# Altium schematic sheet SOC_COMPHY_USB.schdoc: =
size A3; Symbol: Sheet-Symbol_A4; Company: 嘉立创EDA; Version: V1.0; Page Size: A4; @Project Name: RK3568_LPD4X_120P_Core; @Page Count: 18; @Update Date: 2025-08-22; @Create Date: 2025-08-15; @Schematic Name: Schematic1; @Page No: 8; @Page Name: SOC_COMPHY/USB; Device: Sheet-Symbol_A4; Border: 1; Title Block Position: 3; Width: 1655; Height: 1170; Region Start: 1; X Region Count: 6; Y Region Count: 4; Blade Width: 10; @Board Name: Board1; @Create Time: 13:46:06; @Update Time: 16:42:04; Organization: ORGANIZATION; Address1: ADDRESS 1; Address2: ADDRESS 2; Address3: ADDRESS 3; Address4: ADDRESS 4; SheetNumber: 10; SheetTotal: 28
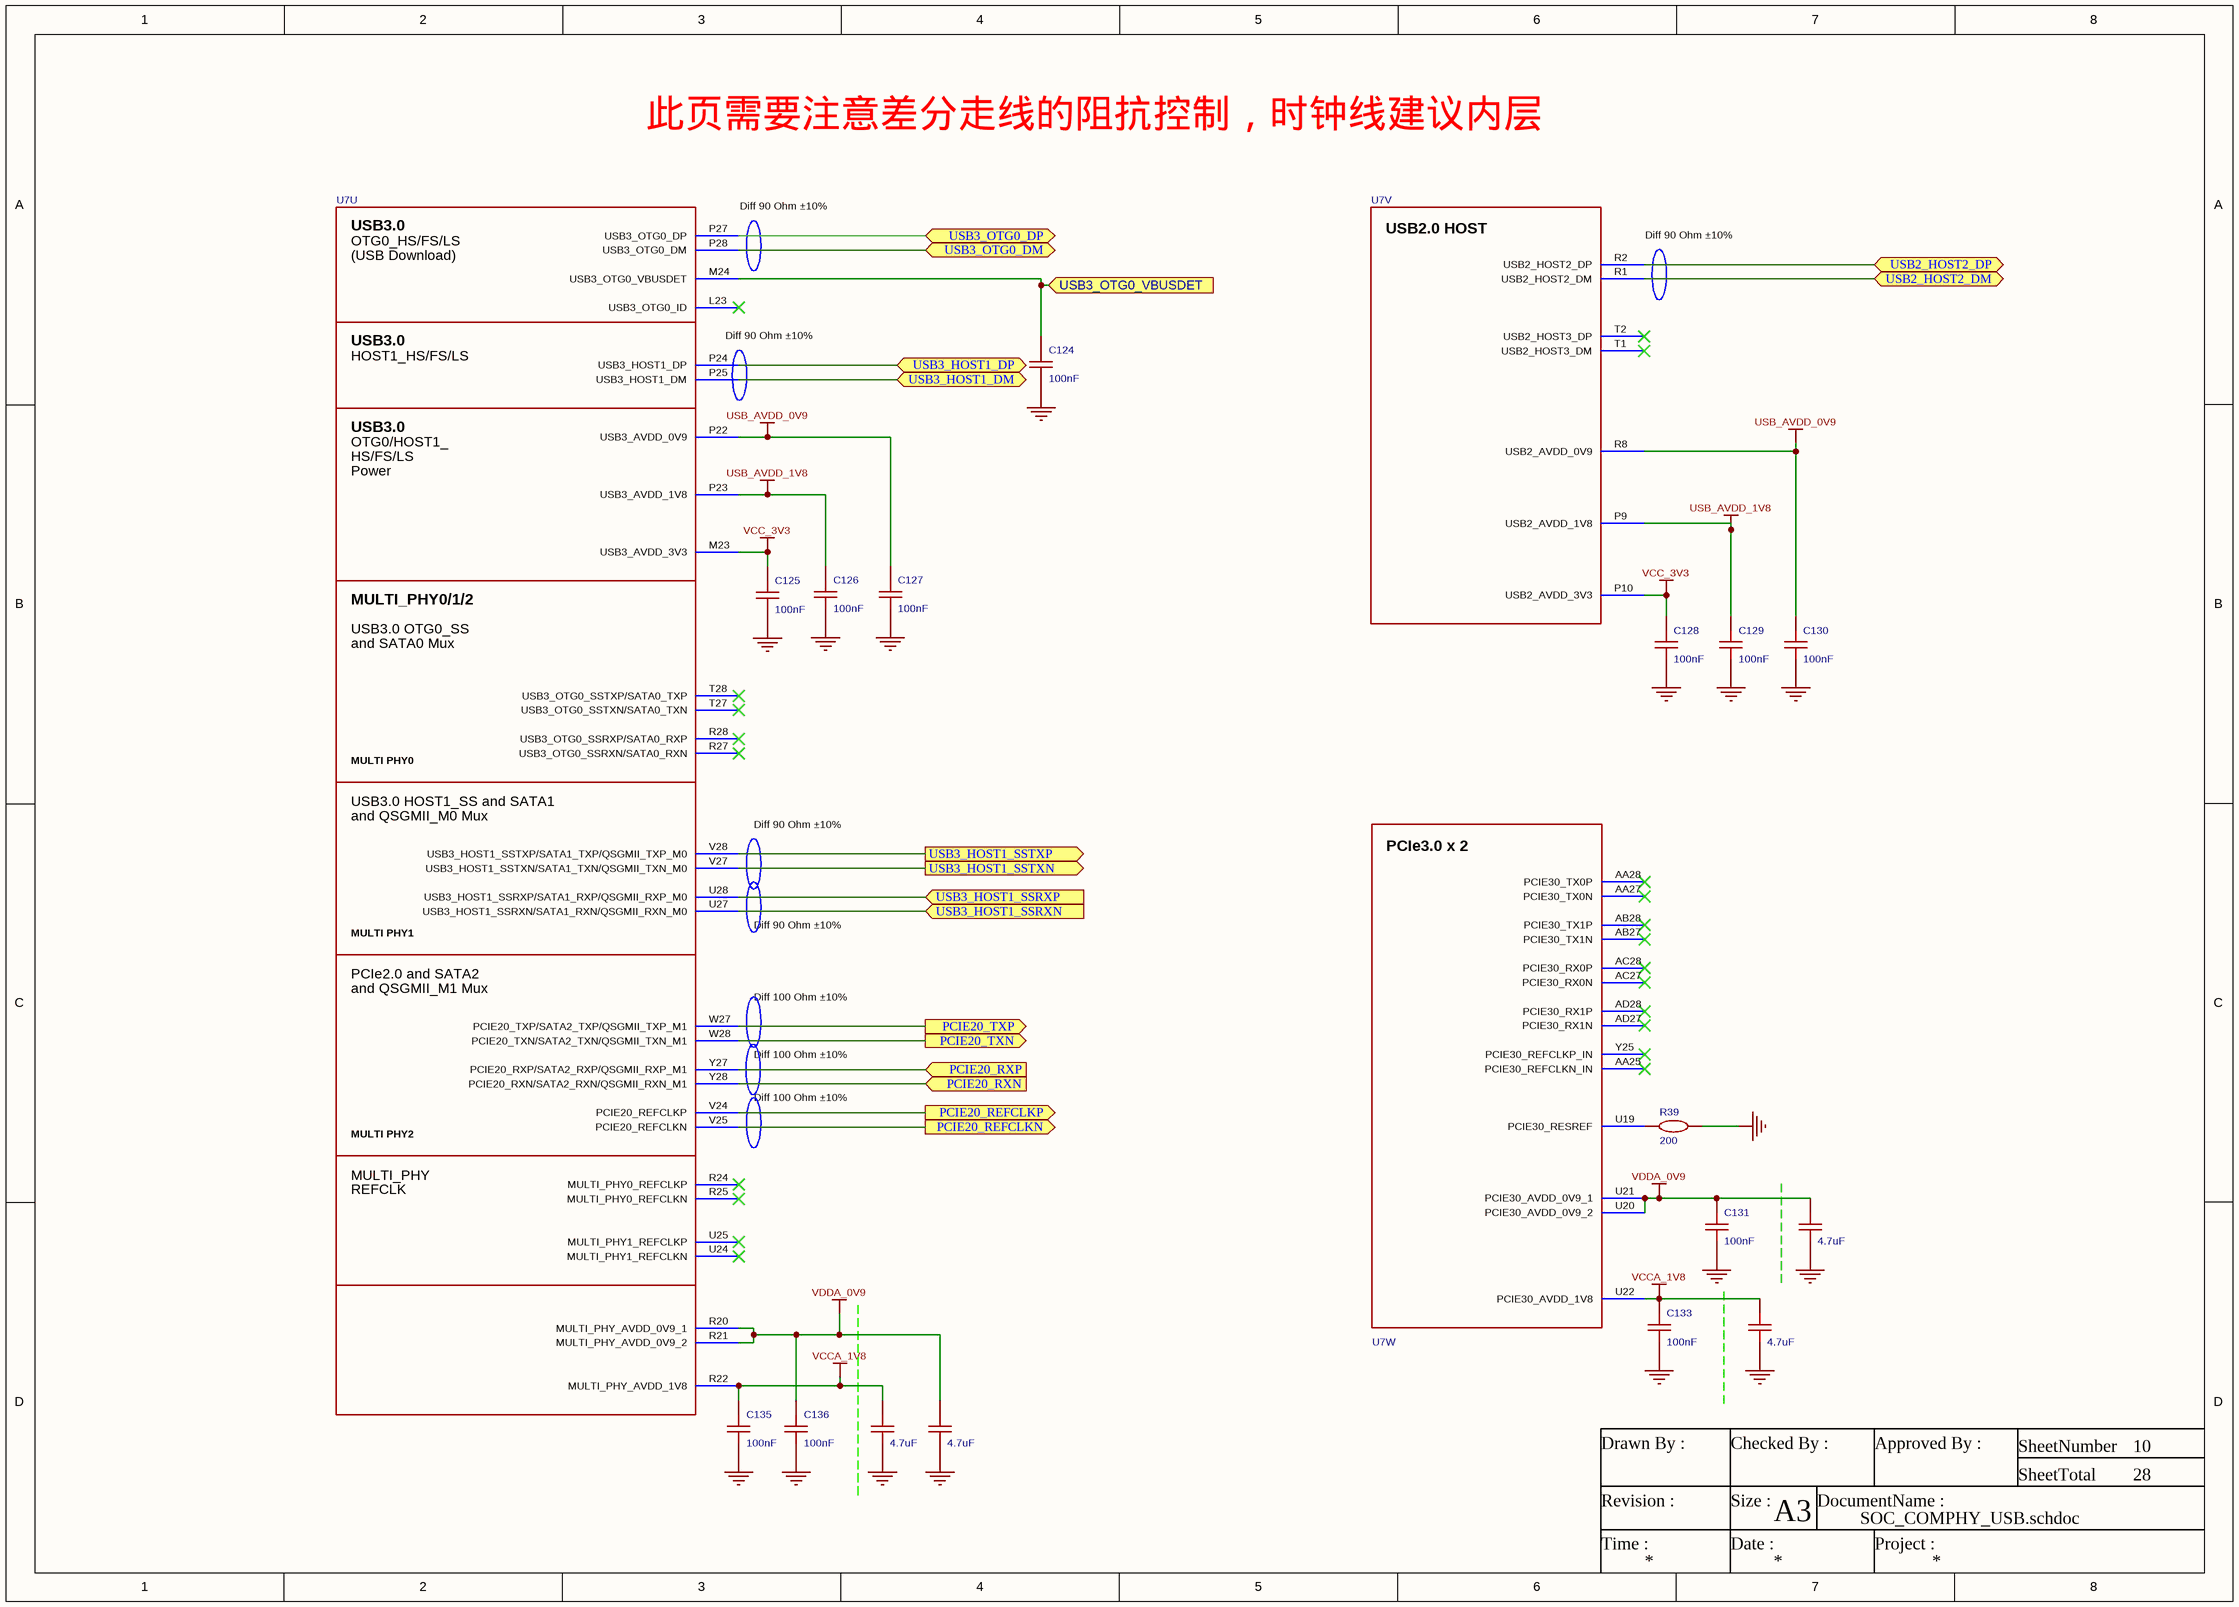
[diagram p0: SOC_COMPHY_USB.schdoc]

## Parts
C124  100nF  [C0201]
C125  100nF  [C0201]
C126  100nF  [C0201]
C127  100nF  [C0201]
C128  100nF  [C0201]
C129  100nF  [C0201]
C130  100nF  [C0201]
C131  100nF  [C0201]
C132  value 4.7uF  [MYC0402]  (hidden comment: CL10A105KB8NNNC)
C133  100nF  [C0201]
C134  value 4.7uF  [MYC0402]  (hidden comment: CL10A105KB8NNNC)
C135  100nF  [C0201]
C136  100nF  [C0201]
C137  value 4.7uF  [MYC0402]  (hidden comment: CL10A105KB8NNNC)
C138  value 4.7uF  [MYC0402]  (hidden comment: CL10A105KB8NNNC)
R39  200  [R0201]
U7  RK3568  [BGA-636_L19.0-W19.0-P0.65-BL]  (value not drawn)  (parts U,V,W of 23)

## Ports
PCIE20_REFCLKN (out), PCIE20_REFCLKP (out), PCIE20_RXN (in), PCIE20_RXP (in), PCIE20_TXN (out), PCIE20_TXP (out), USB2_HOST2_DM (bidir), USB2_HOST2_DP (bidir), USB3_HOST1_DM (bidir), USB3_HOST1_DP (bidir), USB3_HOST1_SSRXN (in), USB3_HOST1_SSRXP (in), USB3_HOST1_SSTXN (out), USB3_HOST1_SSTXP (out), USB3_OTG0_DM (bidir), USB3_OTG0_DP (bidir), USB3_OTG0_VBUSDET (in)

## Nets
GND: C124.1 C125.1 C126.1 C127.1 C128.1 C129.1 C130.1 C131.1 C132.1 C133.1 C134.1 C135.1 C136.1 C137.1 C138.1 R39.2
USB_AVDD_0V9: C127.2 C130.2 U7.P22(USB3_AVDD_0V9) U7.R8(USB2_AVDD_0V9)
USB_AVDD_1V8: C126.2 C129.2 U7.P9(USB2_AVDD_1V8) U7.P23(USB3_AVDD_1V8)
VCC_3V3: C125.2 C128.2 U7.M23(USB3_AVDD_3V3) U7.P10(USB2_AVDD_3V3)
VCCA_1V8: C133.2 C134.2 C135.2 C137.2 U7.R22(MULTI_PHY_AVDD_1V8) U7.U22(PCIE30_AVDD_1V8)
VDDA_0V9: C131.2 C132.2 C136.2 C138.2 U7.R20(MULTI_PHY_AVDD_0V9_1) U7.R21(MULTI_PHY_AVDD_0V9_2) U7.U20(PCIE30_AVDD_0V9_2) U7.U21(PCIE30_AVDD_0V9_1)
PCIE20_REFCLKN: U7.V25(PCIE20_REFCLKN) ; port PCIE20_REFCLKN
PCIE20_REFCLKP: U7.V24(PCIE20_REFCLKP) ; port PCIE20_REFCLKP
PCIE20_RXN: U7.Y28(PCIE20_RXN/SATA2_RXN/QSGMII_RXN_M1) ; port PCIE20_RXN
PCIE20_RXP: U7.Y27(PCIE20_RXP/SATA2_RXP/QSGMII_RXP_M1) ; port PCIE20_RXP
PCIE20_TXN: U7.W28(PCIE20_TXN/SATA2_TXN/QSGMII_TXN_M1) ; port PCIE20_TXN
PCIE20_TXP: U7.W27(PCIE20_TXP/SATA2_TXP/QSGMII_TXP_M1) ; port PCIE20_TXP
USB2_HOST2_DM: U7.R1(USB2_HOST2_DM) ; port USB2_HOST2_DM
USB2_HOST2_DP: U7.R2(USB2_HOST2_DP) ; port USB2_HOST2_DP
USB3_HOST1_DM: U7.P25(USB3_HOST1_DM) ; port USB3_HOST1_DM
USB3_HOST1_DP: U7.P24(USB3_HOST1_DP) ; port USB3_HOST1_DP
USB3_HOST1_SSRXN: U7.U27(USB3_HOST1_SSRXN/SATA1_RXN/QSGMII_RXN_M0) ; port USB3_HOST1_SSRXN
USB3_HOST1_SSRXP: U7.U28(USB3_HOST1_SSRXP/SATA1_RXP/QSGMII_RXP_M0) ; port USB3_HOST1_SSRXP
USB3_HOST1_SSTXN: U7.V27(USB3_HOST1_SSTXN/SATA1_TXN/QSGMII_TXN_M0) ; port USB3_HOST1_SSTXN
USB3_HOST1_SSTXP: U7.V28(USB3_HOST1_SSTXP/SATA1_TXP/QSGMII_TXP_M0) ; port USB3_HOST1_SSTXP
USB3_OTG0_DM: U7.P28(USB3_OTG0_DM) ; port USB3_OTG0_DM
USB3_OTG0_DP: U7.P27(USB3_OTG0_DP) ; port USB3_OTG0_DP
USB3_OTG0_VBUSDET: C124.2 U7.M24(USB3_OTG0_VBUSDET) ; port USB3_OTG0_VBUSDET
NetR39_1: R39.1 U7.U19(PCIE30_RESREF)

Not connected (* = marked no-connect by the designer): U7 AA25(PCIE30_REFCLKN_IN)* AA27(PCIE30_TX0N)* AA28(PCIE30_TX0P)* AB27(PCIE30_TX1N)* AB28(PCIE30_TX1P)* AC27(PCIE30_RX0N)* AC28(PCIE30_RX0P)* AD27(PCIE30_RX1N)* AD28(PCIE30_RX1P)* L23(USB3_OTG0_ID)* R24(MULTI_PHY0_REFCLKP)* R25(MULTI_PHY0_REFCLKN)* R27(USB3_OTG0_SSRXN/SATA0_RXN)* R28(USB3_OTG0_SSRXP/SATA0_RXP)* T1(USB2_HOST3_DM)* T2(USB2_HOST3_DP)* T27(USB3_OTG0_SSTXN/SATA0_TXN)* T28(USB3_OTG0_SSTXP/SATA0_TXP)* U24(MULTI_PHY1_REFCLKN)* U25(MULTI_PHY1_REFCLKP)* Y25(PCIE30_REFCLKP_IN)*

## Notes on the sheet
- 此页需要注意差分走线的阻抗控制，时钟线建议内层
- (near U7) Diff 90 Ohm ±10%
- Diff 90 Ohm ±10%
- Diff 100 Ohm ±10%
- Drawn By :
- Checked By :
- Approved By :
- SheetNumber
- SheetTotal
- Revision :
- Time :
- Size :
- Date :
- A3
- DocumentName :
- Project :
- (in symbol RK3568, part U) USB3.0; OTG0_HS/FS/LS; (USB Download); HOST1_HS/FS/LS; OTG0/HOST1_; HS/FS/LS; Power; MULTI_PHY0/1/2; USB3.0 OTG0_SS; and SATA0 Mux; MULTI PHY0; USB3.0 HOST1_SS and SATA1; and QSGMII_M0 Mux; MULTI PHY1; PCIe2.0 and SATA2; and QSGMII_M1 Mux; MULTI PHY2; MULTI_PHY; REFCLK
- (in symbol RK3568, part V) USB2.0 HOST
- (in symbol RK3568, part W) PCIe3.0 x 2

## Library data of the parts
C124-C131 C133 C135 C136 = GRM035R60J475ME15D: 容值:4.7uF;精度:±20%;额定电压:6.3V;温度系数:X5R;; Manufacturer: muRata(村田); AddInBom: yes; ModelId: e8033a7cb35143ffb28e3b81b2577ea0; ModelName: C0201_L0.6-W0.3-H0.3; ModelTransform: 23.622,11.811,0,0,0,0,0,0,0; Tolerance: ±20%; Voltage Rating: 6.3V; Temperature Coefficient: X5R; Symbol: GRM035R60J475ME15D; Value: 100nF; Device: GRM035R60J475ME15D; LCSC Part Name: 4.7uF ±20% 6.3V; ManufacturerPart: GRM035R60J475ME15D; Supplier Footprint: 0201; JLCPCB Part Class: Extended Part; Datasheet: https://item.szlcsc.com/datasheet/GRM035R60J475ME15D/313624.html; Supplier: LCSC; ConvertToPcb: yes; FootprintName: C0201
C132 C134 C137 C138 = CL10A105KB8NNNC: 容值:1uF;精度:±10%;额定电压:50V;材质(温度系数):X5R;; Manufacturer: SAMSUNG(三星); Symbol: CapAcitance; 3D Model: 36a51122f27c49738f86b3bfa98863e0; AddInBom: yes; ModelName: C0603_L1.6-W0.8-H0.8; ModelTransform: 62.992,31.496,0,0,0,0,0,0,0; Tolerance: ±10%; Voltage Rated: 50V; Temperature Coefficient: X5R; Device: CL10A105KB8NNNC; LCSC Part Name: 1uF ±10% 50V; ManufacturerPart: CL10A105KB8NNNC; Supplier Footprint: 0603; JLCPCB Part Class: Basic Part; Datasheet: https://atta.szlcsc.com/upload/public/pdf/source/20160103/1457707679084.pdf; Supplier: LCSC; ConvertToPcb: yes; FootprintName: MYC0402
R39 = Res_0201: ConvertToPcb: yes; SymbolName: 电阻; ModelId: 0e006ba4c37b4b73b0e85d5d1c6800cb; ModelName: R0201_L0.6-W0.3-H0.3; ModelTransform: 23.622,11.811,0,0,0,0,0,-0.0005,0; Value: 200; Device: Res_0201; AddInBom: yes; Supplier Footprint: 0201; FootprintName: R0201
U7 = RK3568: ConvertToPcb: yes; ModelId: e6756cba1b9f43448429fdcd1d44d9d9; ModelTransform: 748.03,748.03,54.33,0,0,0,0,0,0; Symbol: RK3568; Device: RK3568; AddInBom: yes; FootprintName: BGA-636_L19.0-W19.0-P0.65-BL; ModelName: BGA-636_L19.0-W19.0-P0.65-BL